# Altium schematic sheet Payload.SchDoc
size A4
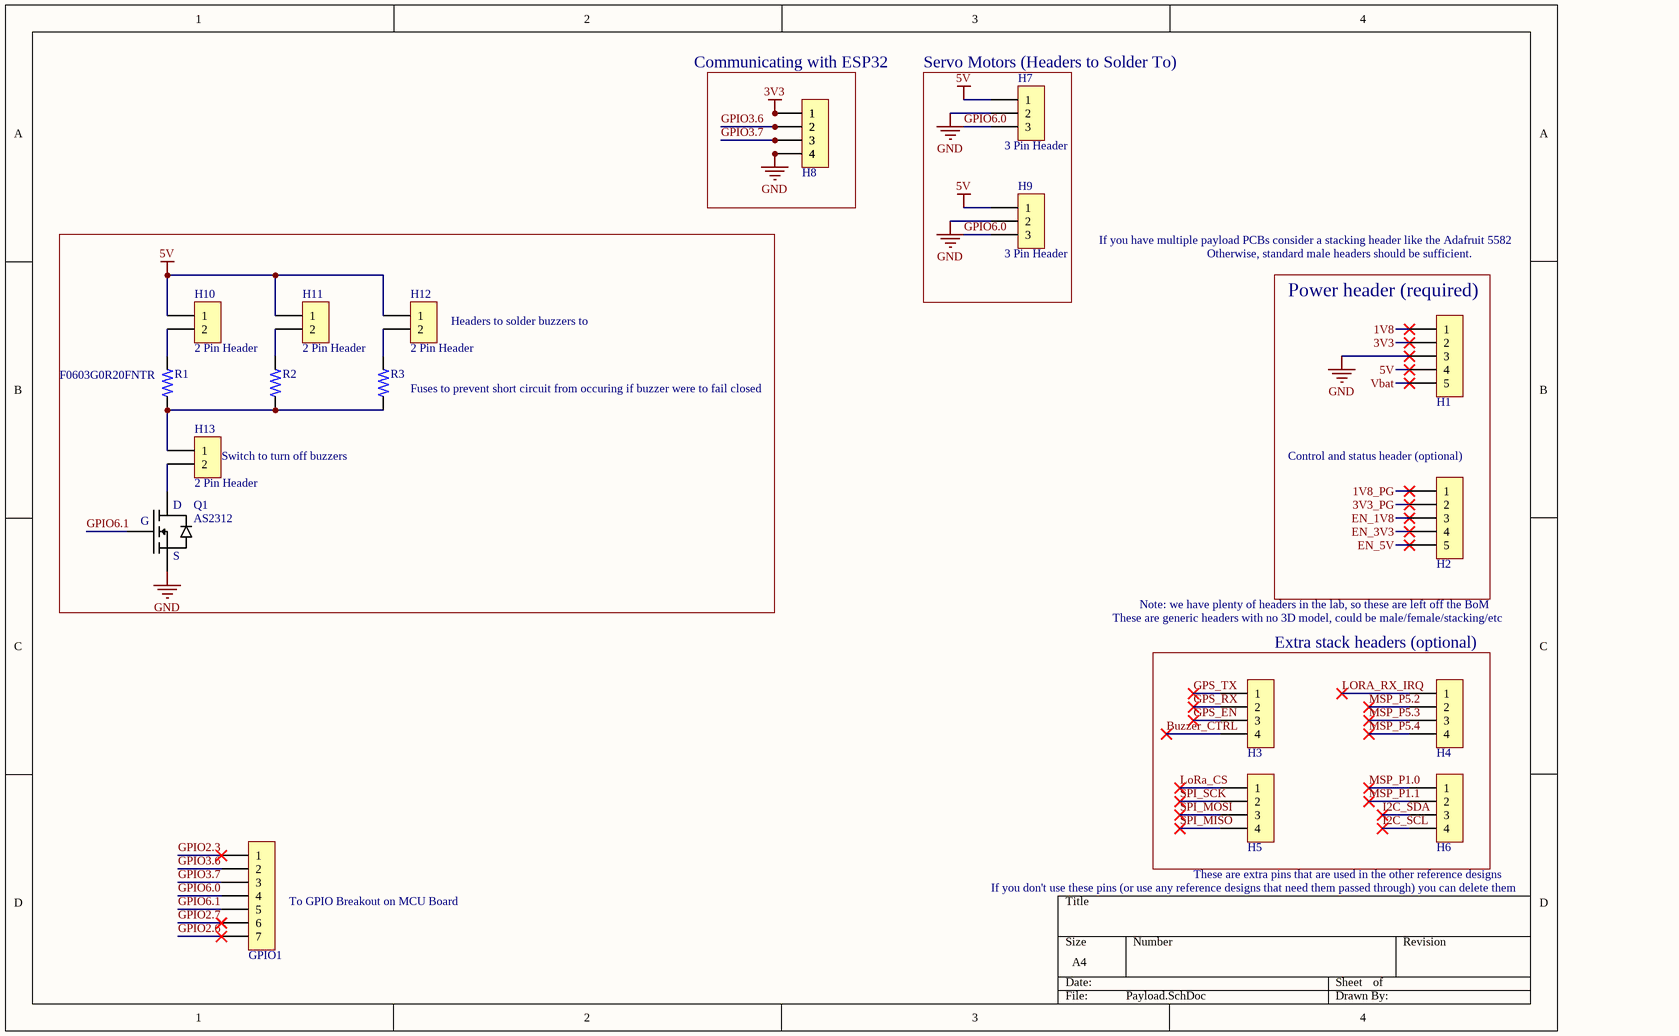
[diagram p0: Payload.SchDoc]

## Parts
GPIO1  HDR,2.54mm,1x7  [HEADER_2.54MM_1x7PIN]  (value not drawn)  (no BOM)
H1  Header - 2.54mm,1x5-pin  [HEADER_2.54MM_1x5PIN]  (value not drawn)  (no BOM)
H2  Header - 2.54mm,1x5-pin  [HEADER_2.54MM_1x5PIN]  (value not drawn)  (no BOM)
H3  Header - 2.54mm,1x4-pin  [HEADER_2.54MM_1x4PIN]  (value not drawn)  (no BOM)
H4  Header - 2.54mm,1x4-pin  [HEADER_2.54MM_1x4PIN]  (value not drawn)  (no BOM)
H5  Header - 2.54mm,1x4-pin  [HEADER_2.54MM_1x4PIN]  (value not drawn)  (no BOM)
H6  Header - 2.54mm,1x4-pin  [HEADER_2.54MM_1x4PIN]  (value not drawn)  (no BOM)
H7  3 Pin Header  [3 Pin Header]  (no BOM)
H8  Header - 2.54mm,1x4-pin  [HEADER_2.54MM_1x4PIN]  (value not drawn)  (no BOM)
H9  3 Pin Header  [3 Pin Header]  (no BOM)
H10  2 Pin Header  [2 Pin Header]  (no BOM)
H11  2 Pin Header  [2 Pin Header]  (no BOM)
H12  2 Pin Header  [2 Pin Header]  (no BOM)
H13  2 Pin Header  [2 Pin Header]  (no BOM)
Q1  AS2312  [SOT23-3N-1.15mm]
R1  F0603G0R20FNTR  [CAPC1608X90]
R2  F0603G0R20FNTR  [CAPC1608X90]  (value not drawn)
R3  F0603G0R20FNTR  [CAPC1608X90]  (value not drawn)

## Blocks framed on the sheet
Servo Motors (Headers to Solder To): H7 H9
Power header (required): H1 H2
Extra stack headers (optional): H3-H6

## Nets
3V3: H1.2 H8.1
5V: H1.4 H7.1 H9.1 H10.1 H11.1 H12.1
GND: H1.3 H7.2 H8.4 H9.2 Q1.2(S)
1V8: H1.1
1V8_PG: H2.1
3V3_PG: H2.2
Buzzer_CTRL: H3.4
EN_1V8: H2.3
EN_3V3: H2.4
EN_5V: H2.5
GPIO2.3: GPIO1.1
GPIO2.6: GPIO1.7
GPIO2.7: GPIO1.6
GPIO3.6: GPIO1.2 H8.2
GPIO3.7: GPIO1.3 H8.3
GPIO6.0: GPIO1.4 H7.3 H9.3
GPIO6.1: GPIO1.5 Q1.1(G)
GPS_EN: H3.3
GPS_RX: H3.2
GPS_TX: H3.1
I2C_SCL: H6.4
I2C_SDA: H6.3
LoRa_CS: H5.1
LORA_RX_IRQ: H4.1
MSP_P1.0: H6.1
MSP_P1.1: H6.2
MSP_P5.2: H4.2
MSP_P5.3: H4.3
MSP_P5.4: H4.4
SPI_MISO: H5.4
SPI_MOSI: H5.3
SPI_SCK: H5.2
Vbat: H1.5
NetH10_2: H10.2 R1.2
NetH11_2: H11.2 R2.2
NetH12_2: H12.2 R3.2
NetH13_1: H13.1 R1.1 R2.1 R3.1
NetH13_2: H13.2 Q1.3(D)

## Notes on the sheet
- (near H8) Communicating with ESP32
- If you have multiple payload PCBs consider a stacking header like the Adafruit 5582
- Otherwise, standard male headers should be sufficient.
- (near H12) Headers to solder buzzers to
- (near R3) Fuses to prevent short circuit from occuring if buzzer were to fail closed
- (near H13) Switch to turn off buzzers
- (near H2) Control and status header (optional)
- These are generic headers with no 3D model, could be male/female/stacking/etc
- Note: we have plenty of headers in the lab, so these are left off the BoM
- (near GPIO1) To GPIO Breakout on MCU Board
- If you don't use these pins (or use any reference designs that need them passed through) you can delete them
- These are extra pins that are used in the other reference designs

## Library data of the parts
GPIO1 = HDR,2.54mm,1x7: Connector - 2.54mm, 1x7-pin
Q1 = AS2312: Transistor - MOSFET, N-Channel AS2312; APSS Standard Part: APSS Standard; Temp Range: 0°C ~ 150°C (TJ); Rated Voltage: 20 Vds; Power: 1.2W; MF Part No.: AS2312; Package: SOT-23-3; Supplier 1: Digikey; Supplier 1 Part No.: 4530-AS2312CT-ND
R1-R3 = F0603G0R20FNTR: 200 mA AC 32 V DC Fuse Board Mount (Cartridge Style Excluded) Surface Mount 0603 (1608 Metric); MF: AVX; Value: *; SnapEDA_Link: https://www.snapeda.com/parts/F0603G0R20FNTR/AVX+%252F+Kyocera/view-part/?ref=snap; Purchase-URL: https://pricing.snapeda.com/search/part/F0603G0R20FNTR/?ref=eda; Availability: In Stock; Price: None; Package: 0603-2 AVX; Check_prices: https://www.snapeda.com/parts/F0603G0R20FNTR/AVX+%252F+Kyocera/view-part/?ref=eda; MP: F0603G0R20FNTR